# Altium schematic sheet Micro.SchDoc
size A
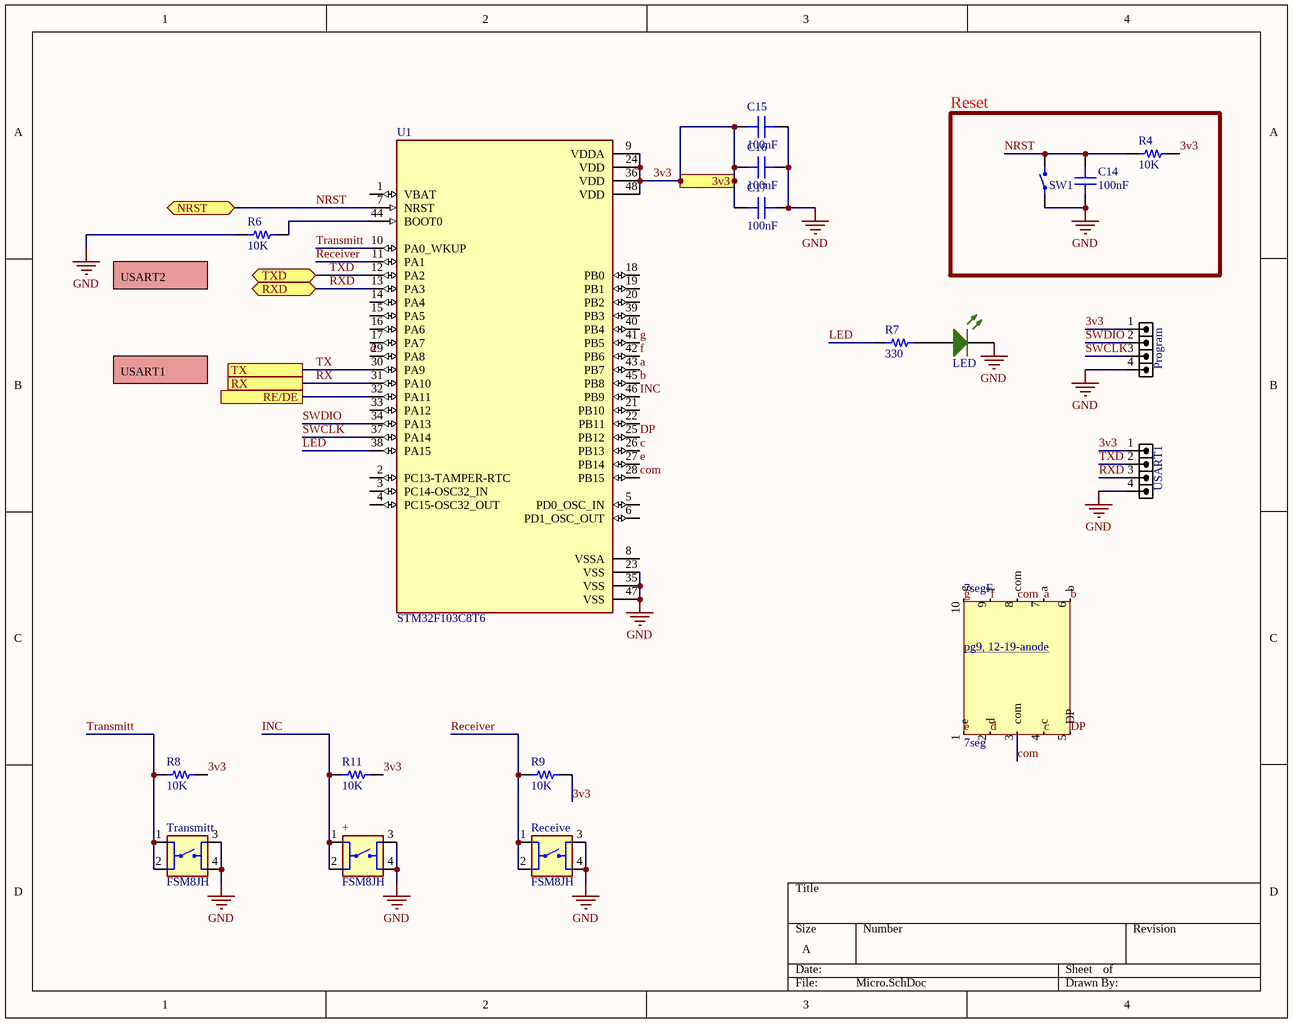
[diagram p0: Micro.SchDoc]

## Parts
7seg  7seg  [PCBComponent_1]  (part F of 6)
+  FSM8JH  [SW_FSM8JH]
C14  100nF  [CAP 0805_2012]
C15  100nF  [CAP 0805_2012]
C16  100nF  [CAP 0805_2012]
C17  100nF  [CAP 0805_2012]
LED  LED SMD 0805 GREEN  [LED_0805_GREEN]  (value not drawn)
Program  HDR1X4  [HDR_1X4]  (value not drawn)
R4  10K  [RES 0805_2012]
R6  10K  [RES 0805_2012]
R7  330  [RES 0805_2012]
R8  10K  [RES 0805_2012]
R9  10K  [RES 0805_2012]
R11  10K  [RES 0805_2012]
Receive  FSM8JH  [SW_FSM8JH]
SW1  Tactile 2PIN 6X3.5mm H4.57mm (SMD)  [SWPBS_SPST_6X3X5]  (value not drawn)
Transmitt  FSM8JH  [SW_FSM8JH]
U1  STM32F103C8T6  [QFP50P900X900X160-48N]
USART1  HDR1X4  [HDR_1X4]  (value not drawn)

## Blocks framed on the sheet
Reset: C14 R4 SW1

## Ports
3v3 (in), NRST (bidir), RE/DE, RX, RXD (bidir), TX, TXD (bidir)

## Nets
GND: +.3 +.4 C14.1 C15.1 C16.1 C17.1 LED.2(K) Program.4 R6.1 Receive.3 Receive.4 SW1.1 Transmitt.3 Transmitt.4 U1.23(VSS) U1.35(VSS) U1.47(VSS) USART1.4
3v3: C15.2 C16.2 C17.2 Program.1 R4.2 R8.2 R9.2 R11.2 U1.9(VDDA) U1.24(VDD) U1.36(VDD) U1.48(VDD) USART1.1 ; port 3v3
a: 7seg.7(a) U1.43(PB7)
b: 7seg.6(b) U1.45(PB8)
c: 7seg.4(c) U1.26(PB13)
com: 7seg.3(com) 7seg.8(com) U1.28(PB15)
d: 7seg.2(d) U1.29(PA8)
DP: 7seg.5(DP) U1.25(PB12)
e: 7seg.1(e) U1.27(PB14)
f: 7seg.9(f) U1.42(PB6)
g: 7seg.10(g) U1.41(PB5)
INC: +.1 +.2 R11.1 U1.46(PB9)
LED: R7.1 U1.38(PA15)
NRST: C14.2 R4.1 SW1.2 U1.7(NRST) ; port NRST
RE/DE: U1.32(PA11) ; port RE/DE
Receiver: R9.1 Receive.1 Receive.2 U1.11(PA1)
RX: U1.31(PA10) ; port RX
RXD: U1.13(PA3) USART1.3 ; port RXD
SWCLK: Program.3 U1.37(PA14)
SWDIO: Program.2 U1.34(PA13)
Transmitt: R8.1 Transmitt.1 Transmitt.2 U1.10(PA0_WKUP)
TX: U1.30(PA9) ; port TX
TXD: U1.12(PA2) USART1.2 ; port TXD
NetLED_1: LED.1(A) R7.2
NetR6_2: R6.2 U1.44(BOOT0)

Not connected (* = marked no-connect by the designer): U1 1(VBAT) 2(PC13-TAMPER-RTC) 3(PC14-OSC32_IN) 4(PC15-OSC32_OUT) 5(PD0_OSC_IN) 6(PD1_OSC_OUT) 8(VSSA) 14(PA4) 15(PA5) 16(PA6) 17(PA7) 18(PB0) 19(PB1) 20(PB2) 21(PB10) 22(PB11) 33(PA12) 39(PB3) 40(PB4)

## Notes on the sheet
- (near R6) USART2
- USART1
- (in symbol 7seg, part F) pg9, 12-19-anode

## Library data of the parts
7seg = 7seg: file:///C:/Users/Tamana/Downloads/7SEG-12-19mm-GREEN-ANOD.pdf
+ Receive Transmitt = FSM8JH: Tactile Switch SPST-NO Top Actuated Through Hole; MF: TE Connectivity; Check_prices: https://www.snapeda.com/parts/FSM8JH/TE+Connectivity+ALCOSWITCH+Switches/view-part/?ref=eda; Value: *; Availability: In Stock; MP: FSM8JH; Price: None; Package: None; SnapEDA_Link: https://www.snapeda.com/parts/FSM8JH/TE+Connectivity+ALCOSWITCH+Switches/view-part/?ref=snap
C14-C17 = Cap 0805: SMT Capacitor; VALUE: 100nF
Program USART1 = HDR_1X4: CONN, HEADER, Male, pitch: 2.54mm, 4POS; VALUE: HDRM4
R4 R6-R9 R11 = Res 0805: SMT Resistor; VALUE: 1K
SW1 = Tactile 2PIN 6X3.5mm H4.57mm (SMD): Tactile Switch SPST-NO Top Actuated Surface Mount; PartNumber: FSMSMTR-ND
U1 = STM32F103C8T6: ARM® Cortex®-M3 STM32F1 Microcontroller IC 32-Bit 72MHz 64KB (64K x 8) FLASH 48-LQFP (7x7); MF: STMicroelectronics; SnapEDA_Link: https://www.snapeda.com/parts/STM32F103C8T6/STMicroelectronics/view-part/?ref=snap; Package: LQFP-48 STMicroelectronics; Value: *; MP: STM32F103C8T6; Check_prices: https://www.snapeda.com/parts/STM32F103C8T6/STMicroelectronics/view-part/?ref=eda